# Altium schematic sheet Radar_10GHz.SchDoc
size A4; SheetNumber: 1; SheetTotal: 1
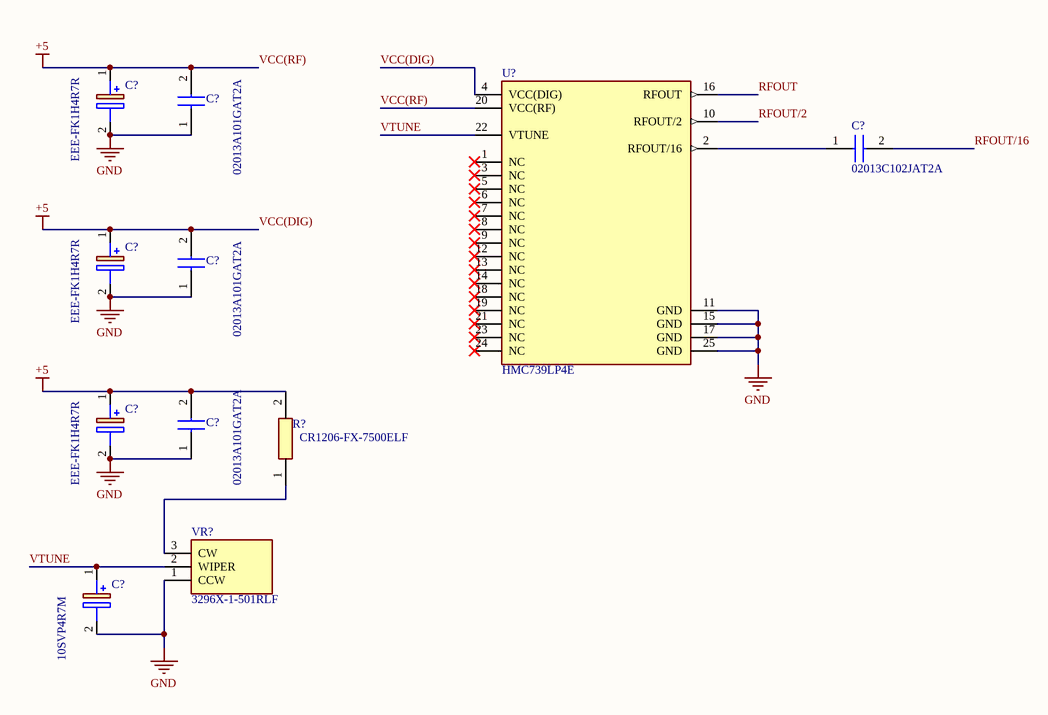
[diagram p0: Radar_10GHz.SchDoc]

## Parts
(Parts that share a designator on the sheet are numbered #1, #2 ... from top to bottom, then left to right.)
C?#1  EEE-FK1H4R7R  [EEE1AA220WR]
C?#2  02013A101GAT2A  [CAPC0603X33N]
C?#3  02013C102JAT2A  [CAPC0603X33N]
C?#4  EEE-FK1H4R7R  [EEE1AA220WR]
C?#5  02013A101GAT2A  [CAPC0603X33N]
C?#6  EEE-FK1H4R7R  [EEE1AA220WR]
C?#7  02013A101GAT2A  [CAPC0603X33N]
C?#8  10SVP4R7M  [10SVPS10M]
R?  CR1206-FX-7500ELF  [RESC3216X75N]
U?  HMC739LP4E  [FP-HCP-24-2-IPC_C]
VR?  3296X-1-501RLF  [3296X1223LF]

## Nets
GND: C?#1.2(-) C?#2.1 C?#4.2(-) C?#5.1 C?#6.2(-) C?#7.1 C?#8.2(-) U?.11(GND) U?.15(GND) U?.17(GND) U?.25(GND) VR?.1(CCW)
VCC(DIG): C?#1.1(+) C?#2.2 C?#4.1(+) C?#5.2 C?#6.1(+) C?#7.2 R?.2 U?.4(VCC(DIG)) U?.20(VCC(RF))  [also labelled +5, VCC(RF)]
RFOUT: U?.16(RFOUT)
RFOUT/2: U?.10(RFOUT/2)
RFOUT/16: C?#3.2
VTUNE: C?#8.1(+) U?.22(VTUNE) VR?.2(WIPER)
NetC?#3_1: C?#3.1 U?.2(RFOUT/16)
NetR?_1: R?.1 VR?.3(CW)

Not connected (* = marked no-connect by the designer): U? 1(NC)* 3(NC)* 5(NC)* 6(NC)* 7(NC)* 8(NC)* 9(NC)* 12(NC)* 13(NC)* 14(NC)* 18(NC)* 19(NC)* 21(NC)* 23(NC)* 24(NC)*

## Library data of the parts
C?#1 C?#4 C?#6 = EEE-FK1H4R7R: Capacitor Polarised; Manufacturer_Name: Panasonic; Datasheet Link: http://industrial.panasonic.com/cdbs/www-data/pdf/RDE0000/ABA0000C1181.pdf; Height: 5.5mm; Manufacturer_Part_Number: EEE-FK1H4R7R; Mouser Part Number: 667-EEE-FK1H4R7R; Mouser Price/Stock: https://www.mouser.co.uk/ProductDetail/Panasonic/EEE-FK1H4R7R?qs=qE6bgDGEOCur97rwuEUvdw%3D%3D; Arrow Part Number: EEE-FK1H4R7R; Arrow Price/Stock: https://www.arrow.com/en/products/eee-fk1h4r7r/panasonic?region=europe
C?#2 C?#5 C?#7 = 02013A101GAT2A: Capacitor; Manufacturer_Name: Kyocera AVX; Datasheet Link: http://www.mouser.com/catalog/supplier/library/pdf/AVXSurfaceMountCeramic.pdf; Height: 0.33mm; Manufacturer_Part_Number: 02013A101GAT2A; Mouser Part Number: 581-02013A101GAT2A; Mouser Price/Stock: https://www.mouser.co.uk/ProductDetail/KYOCERA-AVX/02013A101GAT2A?qs=f21FSZc47PgIfVZWxI2rdg%3D%3D
C?#3 = 02013C102JAT2A: Capacitor; Manufacturer_Name: Kyocera AVX; Datasheet Link: http://www.mouser.com/catalog/supplier/library/pdf/AVXSurfaceMountCeramic.pdf; Height: 0.33mm; Manufacturer_Part_Number: 02013C102JAT2A; Mouser Part Number: 581-02013C102JAT2A; Mouser Price/Stock: https://www.mouser.co.uk/ProductDetail/AVX/02013C102JAT2A?qs=zKeCUPC1TQ0744pweOVFqQ%3D%3D; Arrow Part Number: 02013C102JAT2A; Arrow Price/Stock: https://www.arrow.com/en/products/02013c102jat2a/avx
C?#8 = 10SVP4R7M: Capacitor Polarised; Manufacturer_Name: Panasonic; Datasheet Link: http://industrial.panasonic.com/cdbs/www-data/pdf/AAB8000/AAB8000C193.pdf; Height: 5.5mm; Manufacturer_Part_Number: 10SVP4R7M; Mouser Part Number: 667-10SVP4R7M; Mouser Price/Stock: https://www.mouser.co.uk/ProductDetail/Panasonic/10SVP4R7M?qs=OE1iw1LrrPGNT%2FyEeV%2FacA%3D%3D; Arrow Part Number: 10SVP4R7M; Arrow Price/Stock: https://www.arrow.com/en/products/10svp4r7m/panasonic
R? = CR1206-FX-7500ELF: Resistor; Manufacturer_Name: Bourns; Datasheet Link: http://www.bourns.com/data/global/pdfs/CHPREZTR.pdf; Height: 0.75mm; Manufacturer_Part_Number: CR1206-FX-7500ELF; Mouser Part Number: 652-CR1206FX-7500ELF; Mouser Price/Stock: https://www.mouser.co.uk/ProductDetail/Bourns/CR1206-FX-7500ELF?qs=x5wsLs3ZZ80RF%252BfrW3ztLA%3D%3D; Arrow Part Number: CR1206-FX-7500ELF; Arrow Price/Stock: https://www.arrow.com/en/products/cr1206-fx-7500elf/bourns?region=nac
U? = CMP-09141-000339-1: IC MMIC VCO HBT HALF FREQ 24-QFN; Max Supply Voltage: 5.25V; Frequency: 26.8GHz; Min Supply Voltage: 4.75V; Operating Supply Voltage: 5V; Min Operating Temperature: -40°C; Lead Free: Contains Lead; Mount: Surface Mount; Max Operating Temperature: 85°C; RoHS Compliant: Yes; Reach SVHC Compliant: Yes; Number of Pins: 24; Packaging: Strip; Termination: SMD/SMT; Case/Package: QFN; Series: -; Package Quantity: 50
VR? = 3296X-1-501RLF: Variable Resistor; Manufacturer_Name: Bourns; Datasheet Link: https://www.bourns.com/pdfs/3296.pdf; Height: 10mm; Manufacturer_Part_Number: 3296X-1-501RLF; Mouser Part Number: 652-3296X-1-501RLF; Mouser Price/Stock: https://www.mouser.co.uk/ProductDetail/Bourns/3296X-1-501RLF?qs=pxDZlBjcsCiC1uib8I6u%2FA%3D%3D